# EAGLE design zx81_kbd v0.4 (EAGLE 9.6.2)
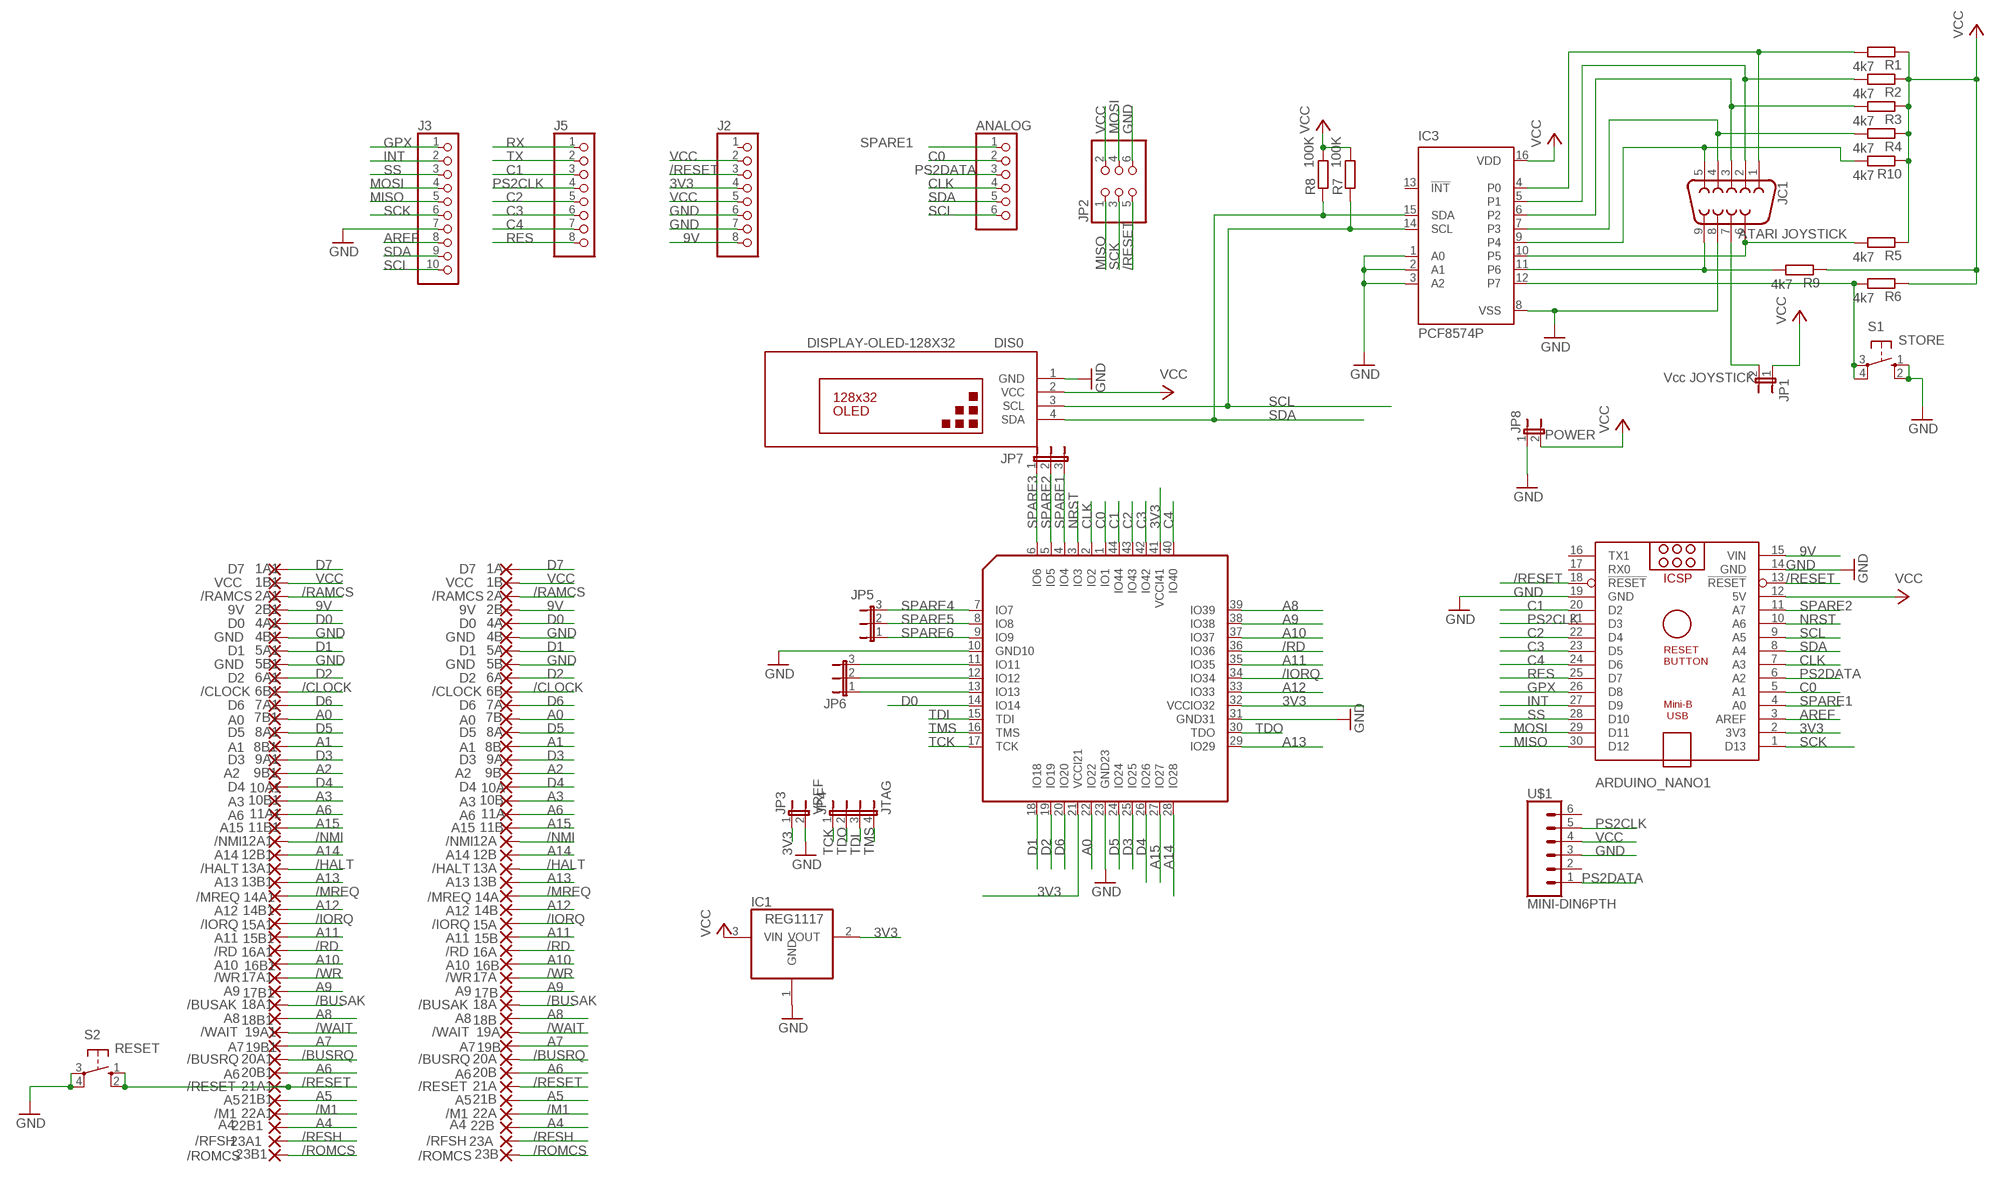
[diagram p0: schematic, sheet 1]

## Parts
1A  D7  SMD2EDGEPIN  [EDGEPIN]
1A1  D7  SMD2EDGEPIN  [EDGEPIN]
1B  VCC  SMD2EDGEPIN  [EDGEPIN]
1B1  VCC  SMD2EDGEPIN  [EDGEPIN]
2A  /RAMCS  SMD2EDGEPIN  [EDGEPIN]
2A1  /RAMCS  SMD2EDGEPIN  [EDGEPIN]
2B  9V  SMD2EDGEPIN  [EDGEPIN]
2B1  9V  SMD2EDGEPIN  [EDGEPIN]
4A  D0  SMD2EDGEPIN  [EDGEPIN]
4A1  D0  SMD2EDGEPIN  [EDGEPIN]
4B  GND  SMD2EDGEPIN  [EDGEPIN]
4B1  GND  SMD2EDGEPIN  [EDGEPIN]
5A  D1  SMD2EDGEPIN  [EDGEPIN]
5A1  D1  SMD2EDGEPIN  [EDGEPIN]
5B  GND  SMD2EDGEPIN  [EDGEPIN]
5B1  GND  SMD2EDGEPIN  [EDGEPIN]
6A  D2  SMD2EDGEPIN  [EDGEPIN]
6A1  D2  SMD2EDGEPIN  [EDGEPIN]
6B  /CLOCK  SMD2EDGEPIN  [EDGEPIN]
6B1  /CLOCK  SMD2EDGEPIN  [EDGEPIN]
7A  D6  SMD2EDGEPIN  [EDGEPIN]
7A1  D6  SMD2EDGEPIN  [EDGEPIN]
7B  A0  SMD2EDGEPIN  [EDGEPIN]
7B1  A0  SMD2EDGEPIN  [EDGEPIN]
8A  D5  SMD2EDGEPIN  [EDGEPIN]
8A1  D5  SMD2EDGEPIN  [EDGEPIN]
8B  A1  SMD2EDGEPIN  [EDGEPIN]
8B1  A1  SMD2EDGEPIN  [EDGEPIN]
9A  D3  SMD2EDGEPIN  [EDGEPIN]
9A1  D3  SMD2EDGEPIN  [EDGEPIN]
9B  A2  SMD2EDGEPIN  [EDGEPIN]
9B1  A2  SMD2EDGEPIN  [EDGEPIN]
10A  D4  SMD2EDGEPIN  [EDGEPIN]
10A1  D4  SMD2EDGEPIN  [EDGEPIN]
10B  A3  SMD2EDGEPIN  [EDGEPIN]
10B1  A3  SMD2EDGEPIN  [EDGEPIN]
11A  A6  SMD2EDGEPIN  [EDGEPIN]
11A1  A6  SMD2EDGEPIN  [EDGEPIN]
11B  A15  SMD2EDGEPIN  [EDGEPIN]
11B1  A15  SMD2EDGEPIN  [EDGEPIN]
12A  /NMI  SMD2EDGEPIN  [EDGEPIN]
12A1  /NMI  SMD2EDGEPIN  [EDGEPIN]
12B  A14  SMD2EDGEPIN  [EDGEPIN]
12B1  A14  SMD2EDGEPIN  [EDGEPIN]
13A  /HALT  SMD2EDGEPIN  [EDGEPIN]
13A1  /HALT  SMD2EDGEPIN  [EDGEPIN]
13B  A13  SMD2EDGEPIN  [EDGEPIN]
13B1  A13  SMD2EDGEPIN  [EDGEPIN]
14A  /MREQ  SMD2EDGEPIN  [EDGEPIN]
14A1  /MREQ  SMD2EDGEPIN  [EDGEPIN]
14B  A12  SMD2EDGEPIN  [EDGEPIN]
14B1  A12  SMD2EDGEPIN  [EDGEPIN]
15A  /IORQ  SMD2EDGEPIN  [EDGEPIN]
15A1  /IORQ  SMD2EDGEPIN  [EDGEPIN]
15B  A11  SMD2EDGEPIN  [EDGEPIN]
15B1  A11  SMD2EDGEPIN  [EDGEPIN]
16A  /RD  SMD2EDGEPIN  [EDGEPIN]
16A1  /RD  SMD2EDGEPIN  [EDGEPIN]
16B  A10  SMD2EDGEPIN  [EDGEPIN]
16B1  A10  SMD2EDGEPIN  [EDGEPIN]
17A  /WR  SMD2EDGEPIN  [EDGEPIN]
17A1  /WR  SMD2EDGEPIN  [EDGEPIN]
17B  A9  SMD2EDGEPIN  [EDGEPIN]
17B1  A9  SMD2EDGEPIN  [EDGEPIN]
18A  /BUSAK  SMD2EDGEPIN  [EDGEPIN]
18A1  /BUSAK  SMD2EDGEPIN  [EDGEPIN]
18B  A8  SMD2EDGEPIN  [EDGEPIN]
18B1  A8  SMD2EDGEPIN  [EDGEPIN]
19A  /WAIT  SMD2EDGEPIN  [EDGEPIN]
19A1  /WAIT  SMD2EDGEPIN  [EDGEPIN]
19B  A7  SMD2EDGEPIN  [EDGEPIN]
19B1  A7  SMD2EDGEPIN  [EDGEPIN]
20A  /BUSRQ  SMD2EDGEPIN  [EDGEPIN]
20A1  /BUSRQ  SMD2EDGEPIN  [EDGEPIN]
20B  A6  SMD2EDGEPIN  [EDGEPIN]
20B1  A6  SMD2EDGEPIN  [EDGEPIN]
21A  /RESET  SMD2EDGEPIN  [EDGEPIN]
21A1  /RESET  SMD2EDGEPIN  [EDGEPIN]
21B  A5  SMD2EDGEPIN  [EDGEPIN]
21B1  A5  SMD2EDGEPIN  [EDGEPIN]
22A  /M1  SMD2EDGEPIN  [EDGEPIN]
22A1  /M1  SMD2EDGEPIN  [EDGEPIN]
22B  A4  SMD2EDGEPIN  [EDGEPIN]
22B1  A4  SMD2EDGEPIN  [EDGEPIN]
23A  /RFSH  SMD2EDGEPIN  [EDGEPIN]
23A1  /RFSH  SMD2EDGEPIN  [EDGEPIN]
23B  /ROMCS  SMD2EDGEPIN  [EDGEPIN]
23B1  /ROMCS  SMD2EDGEPIN  [EDGEPIN]
ANALOG  PINHD-1X6  [1X06]
ARDUINO_NANO1  ARDUINO_NANO  [ARDUINO_NANO]
DIS0  DISPLAY-OLED-128X32  [DISPLAY-OLED-128X32]
IC1  REG1117  [SOT223]
IC3  PCF8574P  [DIL16]
J2  PINHD-1X8  [1X08]
J3  PINHD-1X10  [1X10]
J5  PINHD-1X8  [1X08]
JC1  ATARI JOYSTICK  DB9MALE  [DB9_MALE]
JP1  Vcc JOYSTICK  JP1E  [JP1]
JP2  PINHD-2X3  [2X03]
JP3  VREF  JP1E  [JP1]
JP4  JTAG  JP4E  [JP4]
JP5  JP2E  [JP2]
JP6  JP2E  [JP2]
JP7  JP2E  [JP2]
JP8  POWER  JP1E  [JP1]
R1  4k7  R-EU_0204/7  [0204/7]
R2  4k7  R-EU_0204/7  [0204/7]
R3  4k7  R-EU_0204/7  [0204/7]
R4  4k7  R-EU_0204/7  [0204/7]
R5  4k7  R-EU_0204/7  [0204/7]
R6  4k7  R-EU_0204/7  [0204/7]
R7  100K  R-EU_0204/7  [0204/7]
R8  100K  R-EU_0204/7  [0204/7]
R9  4k7  R-EU_0204/7  [0204/7]
R10  4k7  R-EU_0204/7  [0204/7]
S1  STORE  10-XX11MM  [B3F-10XX_11MM]
S2  RESET  10-XX11MM  [B3F-10XX_11MM]
U$1  MINI-DIN6PTH  [MINI-DIN6]
XC95CPLD  XC9572PLC  [3M44]

## Nets
3V3 [VCC]: ARDUINO_NANO1.2(3V3) IC1.2(VOUT) J2.4 JP3.1 XC95CPLD.21(VCCI21) XC95CPLD.32(VCCIO32) XC95CPLD.41(VCCI41)
9V [VCC]: 2B1.1(P) 2B.1(P) ARDUINO_NANO1.15(VIN) J2.8
/BUSAK: 18A1.1(P) 18A.1(P)
/BUSRQ: 20A1.1(P) 20A.1(P)
/CLOCK: 6B1.1(P) 6B.1(P)
/HALT: 13A1.1(P) 13A.1(P)
/IORQ: 15A1.1(P) 15A.1(P) XC95CPLD.34(IO34)
/M1: 22A1.1(P) 22A.1(P)
/MREQ: 14A1.1(P) 14A.1(P)
/NMI: 12A1.1(P) 12A.1(P)
/RAMCS: 2A1.1(P) 2A.1(P)
/RD: 16A1.1(P) 16A.1(P) XC95CPLD.36(IO36)
/RESET: 21A1.1(P) 21A.1(P) ARDUINO_NANO1.13(!RESET) ARDUINO_NANO1.18(!RESET) J2.3 JP2.5 S2.1(S) S2.2(S1)
/RFSH: 23A1.1(P) 23A.1(P)
/ROMCS: 23B1.1(P) 23B.1(P)
/WAIT: 19A1.1(P) 19A.1(P)
/WR: 17A1.1(P) 17A.1(P)
A0: 7B1.1(P) 7B.1(P) XC95CPLD.22(IO22)
A1: 8B1.1(P) 8B.1(P)
A2: 9B1.1(P) 9B.1(P)
A3: 10B1.1(P) 10B.1(P)
A4: 22B1.1(P) 22B.1(P)
A5: 21B1.1(P) 21B.1(P)
A6: 11A1.1(P) 11A.1(P) 20B1.1(P) 20B.1(P)
A7: 19B1.1(P) 19B.1(P)
A8: 18B1.1(P) 18B.1(P) XC95CPLD.39(IO39)
A9: 17B1.1(P) 17B.1(P) XC95CPLD.38(IO38)
A10: 16B1.1(P) 16B.1(P) XC95CPLD.37(IO37)
A11: 15B1.1(P) 15B.1(P) XC95CPLD.35(IO35)
A12: 14B1.1(P) 14B.1(P) XC95CPLD.33(IO33)
A13: 13B1.1(P) 13B.1(P) XC95CPLD.29(IO29)
A14: 12B1.1(P) 12B.1(P) XC95CPLD.28(IO28)
A15: 11B1.1(P) 11B.1(P) XC95CPLD.27(IO27)
AREF: ARDUINO_NANO1.3(AREF) J3.8
C0: ANALOG.2 ARDUINO_NANO1.5(A1) XC95CPLD.1(IO1)
C1: ARDUINO_NANO1.20(D2) J5.3 XC95CPLD.44(IO44)
C2: ARDUINO_NANO1.22(D4) J5.5 XC95CPLD.43(IO43)
C3: ARDUINO_NANO1.23(D5) J5.6 XC95CPLD.42(IO42)
C4: ARDUINO_NANO1.24(D6) J5.7 XC95CPLD.40(IO40)
CLK: ANALOG.4 ARDUINO_NANO1.7(A3) XC95CPLD.2(IO2)
D0: 4A1.1(P) 4A.1(P) XC95CPLD.14(IO14)
D1: 5A1.1(P) 5A.1(P) XC95CPLD.18(IO18)
D2: 6A1.1(P) 6A.1(P) XC95CPLD.19(IO19)
D3: 9A1.1(P) 9A.1(P) XC95CPLD.25(IO25)
D4: 10A1.1(P) 10A.1(P) XC95CPLD.26(IO26)
D5: 8A1.1(P) 8A.1(P) XC95CPLD.24(IO24)
D6: 7A1.1(P) 7A.1(P) XC95CPLD.20(IO20)
D7: 1A1.1(P) 1A.1(P)
GND [VCC]: 4B1.1(P) 4B.1(P) 5B1.1(P) 5B.1(P) ARDUINO_NANO1.14(GND) ARDUINO_NANO1.19(GND) DIS0.1(GND) IC1.1(GND) IC3.1(A0) IC3.2(A1) IC3.3(A2) IC3.8(VSS) J2.6 J2.7 J3.7 JC1.8 JP2.6 JP3.2 JP8.1 S1.1(S) S1.2(S1) S2.3(P) S2.4(P1) U$1.3 XC95CPLD.10(GND10) XC95CPLD.23(GND23) XC95CPLD.31(GND31)
GPX: ARDUINO_NANO1.26(D8) J3.1
INT: ARDUINO_NANO1.27(D9) J3.2
MISO: ARDUINO_NANO1.30(D12) J3.5 JP2.1
MOSI: ARDUINO_NANO1.29(D11) J3.4 JP2.4
N$1: JP6.3 XC95CPLD.11(IO11)
N$2: JP6.2 XC95CPLD.12(IO12)
N$3: JP6.1 XC95CPLD.13(IO13)
N$29: IC3.4(P0) JC1.1 R1.2
N$32: IC3.5(P1) JC1.2 R2.2
N$33: IC3.6(P2) JC1.3 R3.2
N$34: IC3.7(P3) JC1.4 R4.2
N$35: IC3.10(P5) JC1.6 R5.2
N$36: IC3.9(P4) JC1.5 R10.2
N$37: IC3.12(P7) R6.2 S1.3(P) S1.4(P1)
N$38: JC1.7 JP1.2
N$39: IC3.11(P6) JC1.9 R9.2
NRST: ARDUINO_NANO1.10(A6) XC95CPLD.3(IO3)
PS2CLK: ARDUINO_NANO1.21(D3) J5.4 U$1.5
PS2DATA: ANALOG.3 ARDUINO_NANO1.6(A2) U$1.1
RES: ARDUINO_NANO1.25(D7) J5.8
RX: J5.1
SCK: ARDUINO_NANO1.1(D13) J3.6 JP2.3
SCL: ANALOG.6 ARDUINO_NANO1.9(A5) DIS0.3(SCL) IC3.14(SCL) J3.10 R7.1
SDA: ANALOG.5 ARDUINO_NANO1.8(A4) DIS0.4(SDA) IC3.15(SDA) J3.9 R8.1
SPARE1: ANALOG.1 ARDUINO_NANO1.4(A0) JP7.3 XC95CPLD.4(IO4)
SPARE2: ARDUINO_NANO1.11(A7) JP7.2 XC95CPLD.5(IO5)
SPARE3: JP7.1 XC95CPLD.6(IO6)
SPARE4: JP5.3 XC95CPLD.7(IO7)
SPARE5: JP5.2 XC95CPLD.8(IO8)
SPARE6: JP5.1 XC95CPLD.9(IO9)
SS: ARDUINO_NANO1.28(D10) J3.3
TCK: JP4.1 XC95CPLD.17(TCK)
TDI: JP4.3 XC95CPLD.15(TDI)
TDO: JP4.2 XC95CPLD.30(TDO)
TMS: JP4.4 XC95CPLD.16(TMS)
TX: J5.2
VCC [VCC]: 1B1.1(P) 1B.1(P) ARDUINO_NANO1.12(5V) DIS0.2(VCC) IC1.3(VIN) IC3.16(VDD) J2.2 J2.5 JP1.1 JP2.2 JP8.2 R1.1 R2.1 R3.1 R4.1 R5.1 R6.1 R7.2 R8.2 R9.1 R10.1 U$1.4
Unconnected: ARDUINO_NANO1.16(TX1) ARDUINO_NANO1.17(RX0) IC3.13(!INT) J2.1 U$1.2 U$1.6

## Library data of the parts
1A 1A1 1B 1B1 2A 2A1 2B 2B1 4A 4A1 4B 4B1 5A 5A1 5B 5B1 6A 6A1 6B 6B1 7A 7A1 7B 7B1 8A 8A1 8B 8B1 9A 9A1 9B 9B1 10A 10A1 10B 10B1 11A 11A1 11B 11B1 12A 12A1 12B 12B1 13A 13A1 13B 13B1 14A 14A1 14B 14B1 15A 15A1 15B 15B1 16A 16A1 16B 16B1 17A 17A1 17B 17B1 18A 18A1 18B 18B1 19A 19A1 19B 19B1 20A 20A1 20B 20B1 21A 21A1 21B 21B1 22A 22A1 22B 22B1 23A 23A1 23B 23B1 = wirepad:SMD2: SMD PAD
ANALOG = pinhead:PINHD-1X6: PIN HEADER
ARDUINO_NANO1 = ArduinoNanoV30:ARDUINO_NANO: Arduino Nano V3.0 Overview: The Arduino Nano is a small, complete, and breadboard-friendly board based on the ATmega328 (Arduino Nano 3.x) or ATmega168 (Arduino Nano 2.x). It has more or less the same functionality of the Arduino Duemilanove, but in a different package. It lacks only a DC power jack, and works with a Mini-B USB cable instead of a standard one. The Nano was designed and is being produced by Gravitech. Specifications: Microcontroller Atmel ATmega168 or ATmega328 Operating Voltage (logic level) 5 V Input Voltage (recommended) 7-12 V Input Voltage (limits) 6-20 V Digital I/O Pins 14 (of which 6 provide PWM output) Analog Input Pins 8 DC Current per I/O Pin 40 mA Flash Memory 16 KB (ATmega168) or 32 KB (ATmega328) of which 2 KB used by bootloader SRAM 1 KB (ATmega168) or 2 KB (ATmega328) EEPROM 512 bytes (ATmega168) or 1 KB (ATmega328) Clock Speed 16 MHz Dimensions 0.73" x 1.70" Length 45 mm Width 18 mm Weigth 5 g Power: The Arduino Nano can be powered via the Mini-B USB connection, 6-20V unregulated external power supply (pin 30), or 5V regulated external power supply (pin 27). The power source is automatically selected to the highest voltage source. Memory: The ATmega168 has 16 KB of flash memory for storing code (of which 2 KB is used for the bootloader); the ATmega328 has 32 KB, (also with 2 KB used for the bootloader). The ATmega168 has 1 KB of SRAM and 512 bytes of EEPROM (which can be read and written with the EEPROM library); the ATmega328 has 2 KB of SRAM and 1 KB of EEPROM. Input and Output: Each of the 14 digital pins on the Nano can be used as an input or output, using pinMode(), digitalWrite(), and digitalRead() functions. They operate at 5 volts. Each pin can provide or receive a maximum of 40 mA and has an internal pull-up resistor (disconnected by default) of 20-50 kOhms. In addition, some pins have specialized functions. Visit Arduino - ArduinoBoardNano <https://www.arduino.cc/en/Main/ArduinoBoardNano>
DIS0 = diy-modules:DISPLAY-OLED-128X32: 128x32 Dot Matrix OLED Module with I2C interface based on SSD1306 chip More details available here: http://www.tinyosshop.com/index.php?route=product/product&product_id=953 Schematic available here: http://www.tinyosshop.com/datasheet/OLED%2012832.pdf SSD1306 datasheet: https://cdn-shop.adafruit.com/datasheets/SSD1306.pdf Click here to find device on ebay.com <http://www.ebay.com/sch/oled+display+128x32+i2c>
IC1 = burr-brown:REG1117: 800mA and 1A Low Dropout (LDO) Positive Regulator 1.8V, 2.5V, 2.85V, 3.3V, 5V, and Adj; MPN: REG1117
IC3 = micro-philips:PCF8574: I2C-Bus Remote 8-bit I/O expander http://www.semiconductors.philips.com/acrobat_download/datasheets/PCF8574_4.pdf; MPN: PCF8574PN; OC_FARNELL: 204020; OC_NEWARK: 11N8515
J2 J5 = pinhead:PINHD-1X8: PIN HEADER
J3 = pinhead:PINHD-1X10: PIN HEADER
JC1 = SparkFun-Connectors:DB9: DB9 Connector Standard DB9 (D-Sub 9) serial connector. Can be used for CAN bus as well as RS485 and RS232. Footprint production proven. Here is the female version connector we sell at SparkFun: 9 Pin Female Serial Connector - PCB Mount <https://www.sparkfun.com/products/429> (PRT-00429) This connector has been used on the following SparkFun products: SparkFun RS232 Shifter - SMD <https://www.sparkfun.com/products/449> (PRT-00449) SparkFun RS232 Shifter SMD (No DB9) <https://www.sparkfun.com/products/8780> (PRT-08780); PROD_ID: CONN-09904
JP1 JP3 JP8 = jumper:JP1E: JUMPER
JP2 = pinhead:PINHD-2X3: PIN HEADER
JP4 = jumper:JP4E: JUMPER
JP5-JP7 = jumper:JP2E: JUMPER
R1-R10 = rcl:R-EU_: RESISTOR, European symbol; SPICEPREFIX: R
S1 S2 = switch-omron:10-XX: OMRON SWITCH
U$1 = SparkFun-Retired:MINI-DIN6: Mini DIN 6 Connector SparkFun used to sell this connector and has used it on a couple designs, however the connector and the designs are now retired. Mini DIN 6 Connector [RETIRED] <https://www.sparkfun.com/products/retired/8509> SparkFun Key Counter - PS2 [RETIRED] <https://www.sparkfun.com/products/retired/8652> Commonly found on the back of a computer for PS2 keyboard and mice. Schematic and footprint are proven.
XC95CPLD = xilinx_9:XC9572PLC

## Net classes
0 default: width 0.254 mm, drill 0.2 mm, clearance 0.127 mm
1 VCC: width 0.4 mm

## Board
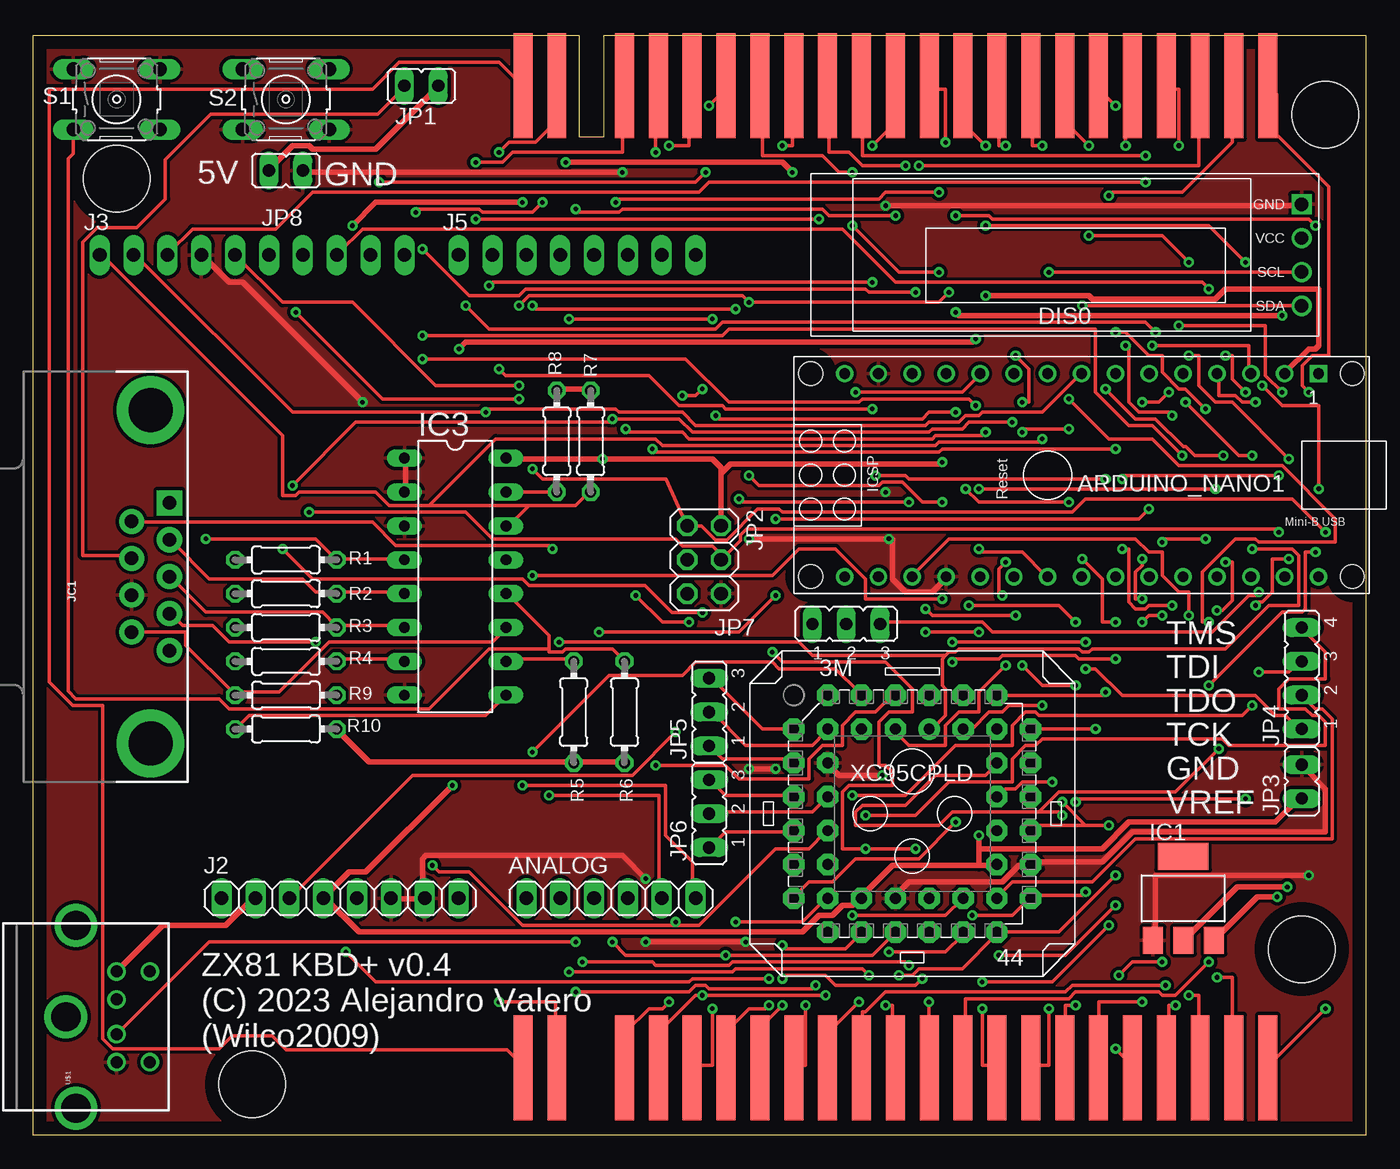
[diagram p1: board, top side]
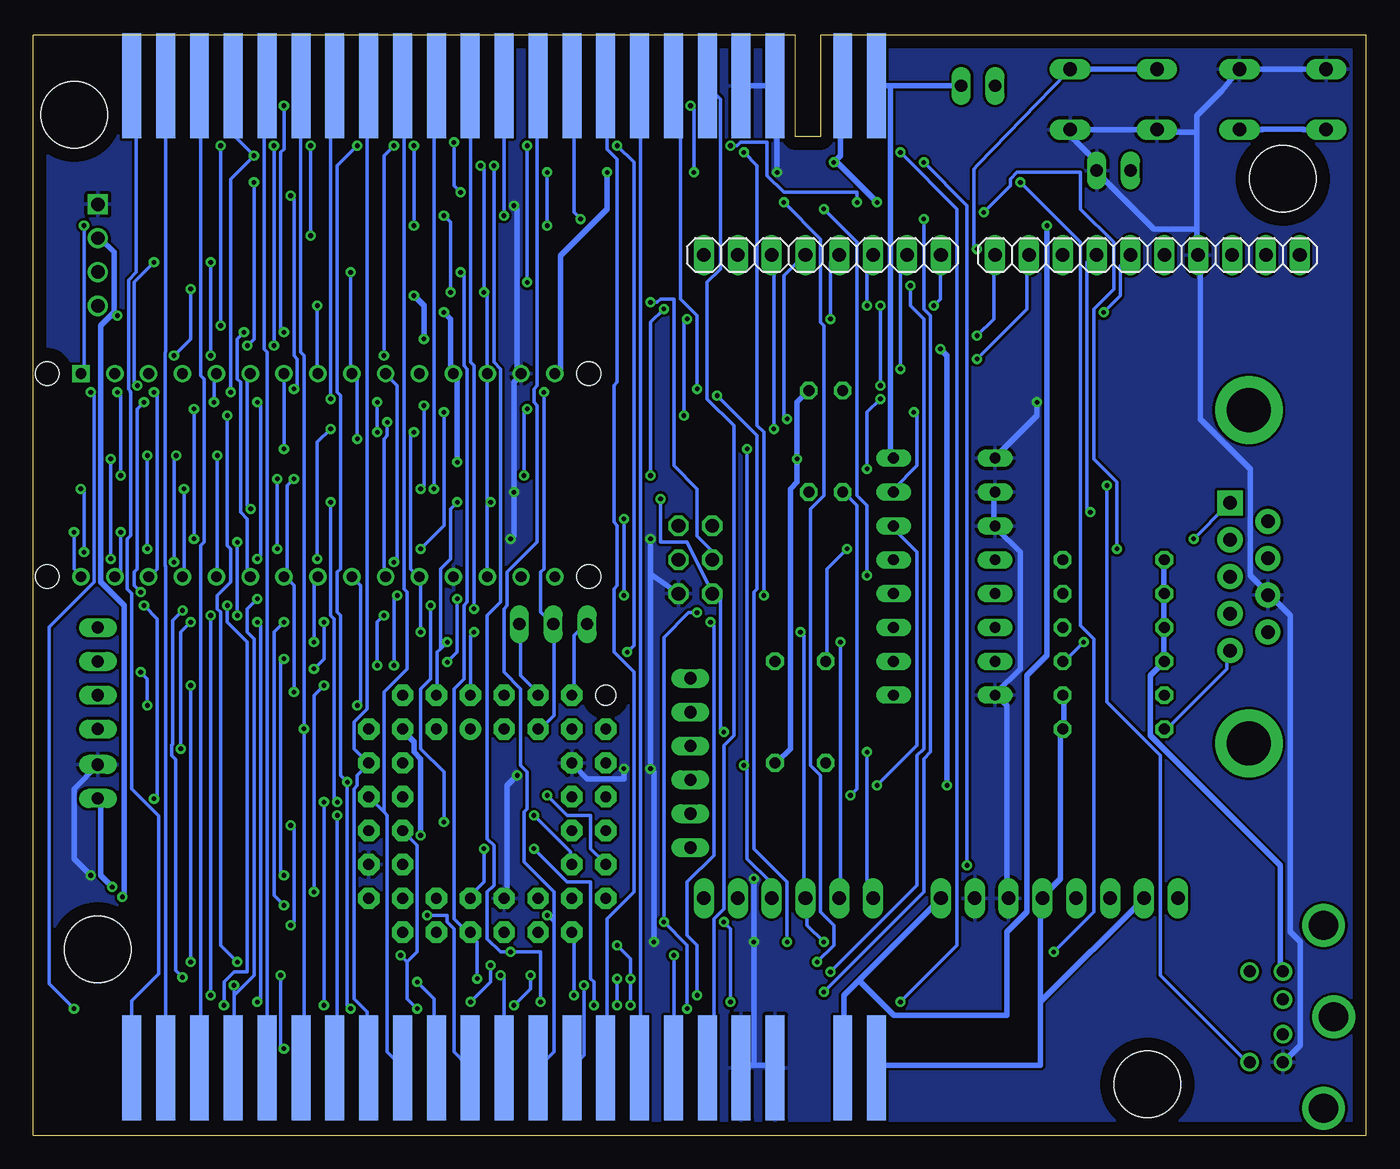
[diagram p2: board, bottom side, seen from below]

Size 99.99 x 82.55 mm. Coordinates in mm from the lower left corner, seen from the top.
Outline: 99.99,0 99.99,82.55 42.83,82.55 42.83,74.93 40.92,74.93 40.92,82.55 0,82.55 0,0 99.99,0
Copper layers (1*16): Top 0.035mm / dielectric 1.5mm / Bottom 0.035mm
Design rules "default": minimum track width 6mil, minimum drill 0.35mm, track to track 6mil, track to pad 6mil, pad to pad 6mil, via to via 6mil, smd to smd 6mil, copper to edge 40mil, drill to drill 6mil, minimum pad ring 10mil, minimum via ring 8mil, stop-mask expansion 4mil, vias tented up to drill 0mil, thermal gap 10mil
Holes 5 mm at 6.25,71.75 16.41,3.81 95.15,13.97 96.93,76.58

### Footprints (pad centres in the part's own frame; a part is rotated, then mirrored left to right if it is on the bottom)
EDGEPIN = smd 1.422 x 7.874: 1 0,0
1X06 = drill 1.016 long: 1 -6.35,0; 2 -3.81,0; 3 -1.27,0; 4 1.27,0; 5 3.81,0; 6 6.35,0
ARDUINO_NANO = drill 0.8 square: 1 -20.32,-7.62 | drill 0.8: 2 -17.78,-7.62; 3 -15.24,-7.62; 4 -12.7,-7.62; 5 -10.16,-7.62; 6 -7.62,-7.62; 7 -5.08,-7.62; 8 -2.54,-7.62; 9 0,-7.62; 10 2.54,-7.62; 11 5.08,-7.62; 12 7.62,-7.62; 13 10.16,-7.62; 14 12.7,-7.62; 15 15.24,-7.62; 16 15.24,7.62; 17 12.7,7.62; 18 10.16,7.62; 19 7.62,7.62; 20 5.08,7.62; 21 2.54,7.62; 22 0,7.62; 23 -2.54,7.62; 24 -5.08,7.62; 25 -7.62,7.62; 26 -10.16,7.62; 27 -12.7,7.62; 28 -15.24,7.62; 29 -17.78,7.62; 30 -20.32,7.62 | hole 1.778: -22.86,-7.62; -22.86,7.62; 17.78,7.62; 17.78,-7.62
DISPLAY-OLED-128X32 = drill 1 square: 1 -17.78,-3.81 | drill 1: 2 -17.78,-1.27; 3 -17.78,1.27; 4 -17.78,3.81
SOT223 = smd 1.499 x 2.007: 1 -2.261,-3.15; 2 0.025,-3.15; 3 2.311,-3.15 | smd 3.81 x 2.007: 4 0,3.15
DIL16 = drill 0.813 long: 1 -8.89,-3.81; 2 -6.35,-3.81; 3 -3.81,-3.81; 4 -1.27,-3.81; 5 1.27,-3.81; 6 3.81,-3.81; 7 6.35,-3.81; 8 8.89,-3.81; 9 8.89,3.81; 10 6.35,3.81; 11 3.81,3.81; 12 1.27,3.81; 13 -1.27,3.81; 14 -3.81,3.81; 15 -6.35,3.81; 16 -8.89,3.81
1X08 = drill 1.016 long: 1 -8.89,0; 2 -6.35,0; 3 -3.81,0; 4 -1.27,0; 5 1.27,0; 6 3.81,0; 7 6.35,0; 8 8.89,0
1X10 = drill 1.016 long: 1 -11.43,0; 2 -8.89,0; 3 -6.35,0; 4 -3.81,0; 5 -1.27,0; 6 1.27,0; 7 3.81,0; 8 6.35,0; 9 8.89,0; 10 11.43,0
DB9_MALE = drill 1.016 pad 1.88 square: 1 5.54,-1.42 | drill 1.016 pad 1.88: 2 2.77,-1.42; 3 0,-1.42; 4 -2.77,-1.42; 5 -5.54,-1.42; 6 4.15,1.42; 7 1.38,1.42; 8 -1.38,1.42; 9 -4.15,1.42 | drill 3.302 pad 5.08: G1 -12.5,0; G2 12.5,0
JP1 = drill 0.914 long: 1 0,-1.27; 2 0,1.27
2X03 = drill 1.016 octagon: 1 -2.54,-1.27; 2 -2.54,1.27; 3 0,-1.27; 4 0,1.27; 5 2.54,-1.27; 6 2.54,1.27
JP4 = drill 0.914 long: 1 -3.81,0; 2 -1.27,0; 3 1.27,0; 4 3.81,0
JP2 = drill 0.914 long: 1 -2.54,0; 2 0,0; 3 2.54,0
0204/7 = drill 0.813 octagon: 1 -3.81,0; 2 3.81,0
B3F-10XX_11MM = drill 1.016 long: 1 -3.251,2.261; 2 3.251,2.261; 3 -3.251,-2.261; 4 3.251,-2.261
MINI-DIN6 = drill 0.9: 1 -1.3,-8.5; 2 1.3,-8.5; 3 -3.4,-8.5; 4 3.4,-8.5; 5 -3.4,-11; 6 3.4,-11 | drill 2.2: P$1 0,-4.7; P$2 -6.858,-5.462; P$3 6.858,-5.462
3M44 = drill 0.813 pad 1.6: 1 1.27,6.35 | drill 0.813 pad 1.6 octagon: 2 -1.27,8.89; 3 -1.27,6.35; 4 -3.81,8.89; 5 -3.81,6.35; 6 -6.35,8.89; 7 -8.89,6.35; 8 -6.35,6.35; 9 -8.89,3.81; 10 -6.35,3.81; 11 -8.89,1.27; 12 -6.35,1.27; 13 -8.89,-1.27; 14 -6.35,-1.27; 15 -8.89,-3.81; 16 -6.35,-3.81; 17 -8.89,-6.35; 18 -6.35,-8.89; 19 -6.35,-6.35; 20 -3.81,-8.89; 21 -3.81,-6.35; 22 -1.27,-8.89; 23 -1.27,-6.35; 24 1.27,-8.89; 25 1.27,-6.35; 26 3.81,-8.89; 27 3.81,-6.35; 28 6.35,-8.89; 29 8.89,-6.35; 30 6.35,-6.35; 31 8.89,-3.81; 32 6.35,-3.81; 33 8.89,-1.27; 34 6.35,-1.27; 35 8.89,1.27; 36 6.35,1.27; 37 8.89,3.81; 38 6.35,3.81; 39 8.89,6.35; 40 6.35,8.89; 41 6.35,6.35; 42 3.81,8.89; 43 3.81,6.35; 44 1.27,8.89 | hole 1.499: -8.89,8.89

### Placement (x,y rotation side)
1A  36.73,5.08 0 top
1A1  36.73,78.74 0 top
1B  36.73,5.08 0 bottom
1B1  36.73,78.74 0 bottom
2A  39.27,5.08 0 top
2A1  39.27,78.74 0 top
2B  39.27,5.08 0 bottom
2B1  39.27,78.74 0 bottom
4A  44.35,5.08 0 top
4A1  44.35,78.74 0 top
4B  44.35,5.08 0 bottom
4B1  44.35,78.74 0 bottom
5A  46.89,5.08 0 top
5A1  46.89,78.74 0 top
5B  46.89,5.08 0 bottom
5B1  46.89,78.74 0 bottom
6A  49.43,5.08 0 top
6A1  49.43,78.74 0 top
6B  49.43,5.08 0 bottom
6B1  49.43,78.74 0 bottom
7A  51.97,5.08 0 top
7A1  51.97,78.74 0 top
7B  51.97,5.08 0 bottom
7B1  51.97,78.74 0 bottom
8A  54.51,5.08 0 top
8A1  54.51,78.74 0 top
8B  54.51,5.08 0 bottom
8B1  54.51,78.74 0 bottom
9A  57.05,5.08 0 top
9A1  57.05,78.74 0 top
9B  57.05,5.08 0 bottom
9B1  57.05,78.74 0 bottom
10A  59.59,5.08 0 top
10A1  59.59,78.74 0 top
10B  59.59,5.08 0 bottom
10B1  59.59,78.74 0 bottom
11A  62.13,5.08 0 top
11A1  62.13,78.74 0 top
11B  62.13,5.08 0 bottom
11B1  62.13,78.74 0 bottom
12A  64.67,5.08 0 top
12A1  64.67,78.74 0 top
12B  64.67,5.08 0 bottom
12B1  64.67,78.74 0 bottom
13A  67.21,5.08 0 top
13A1  67.21,78.74 0 top
13B  67.21,5.08 0 bottom
13B1  67.21,78.74 0 bottom
14A  69.75,5.08 0 top
14A1  69.75,78.74 0 top
14B  69.75,5.08 0 bottom
14B1  69.75,78.74 0 bottom
15A  72.29,5.08 0 top
15A1  72.29,78.74 0 top
15B  72.29,5.08 0 bottom
15B1  72.29,78.74 0 bottom
16A  74.83,5.08 0 top
16A1  74.83,78.74 0 top
16B  74.83,5.08 0 bottom
16B1  74.83,78.74 0 bottom
17A  77.37,5.08 0 top
17A1  77.37,78.74 0 top
17B  77.37,5.08 0 bottom
17B1  77.37,78.74 0 bottom
18A  79.91,5.08 0 top
18A1  79.91,78.74 0 top
18B  79.91,5.08 0 bottom
18B1  79.91,78.74 0 bottom
19A  82.45,5.08 0 top
19A1  82.45,78.74 0 top
19B  82.45,5.08 0 bottom
19B1  82.45,78.74 0 bottom
20A  84.99,5.08 0 top
20A1  84.99,78.74 0 top
20B  84.99,5.08 0 bottom
20B1  84.99,78.74 0 bottom
21A  87.53,5.08 0 top
21A1  87.53,78.74 0 top
21B  87.53,5.08 0 bottom
21B1  87.53,78.74 0 bottom
22A  90.07,5.08 0 top
22A1  90.07,78.74 0 top
22B  90.07,5.08 0 bottom
22B1  90.07,78.74 0 bottom
23A  92.61,5.08 0 top
23A1  92.61,78.74 0 top
23B  92.61,5.08 0 bottom
23B1  92.61,78.74 0 bottom
ANALOG  43.33,17.78 0 top
ARDUINO_NANO1  76.1,49.53 180 top
DIS0  77.37,66.04 180 top
IC1  86.26,17.78 0 top
IC3  31.65,41.91 270 top
J2  23.01,17.78 0 top
J3  16.41,66.04 0 bottom
J5  40.79,66.04 0 bottom
JC1  8.79,41.91 90 top
JP1  29.11,78.74 90 top
JP2  50.32,43.18 270 top
JP3  95.15,26.54 0 top
JP4  95.15,34.29 90 top
JP5  50.7,31.75 90 top
JP6  50.7,24.13 90 top
JP7  60.99,38.35 0 top
JP8  18.95,72.39 90 top
R1  18.95,43.18 0 top
R2  18.95,40.64 0 top
R3  18.95,38.1 0 top
R4  18.95,35.56 0 top
R5  40.54,31.75 90 top
R6  44.35,31.75 90 top
R7  41.81,52.07 90 top
R8  39.27,52.07 90 top
R9  18.95,33.02 180 top
R10  18.95,30.48 180 top
S1  6.25,77.72 0 top
S2  18.95,77.72 0 top
U$1  -2.26,8.89 90 top
XC95CPLD  65.94,24.13 0 top

### Tracks (layer width: path | path; a pad name or v marks a point on that pad's centre or on a via)
3V3  (via drill 0.35)
  Top 0.4: v94.07,18.63 90.32,18.63 86.44,14.75 IC1.2 | 70.94,20.25 72.19,20.25 XC95CPLD.32 | 70.94,20.25 64.44,20.25 62.19,18 XC95CPLD.21 61.94,17.75 61.44,17.25 60.69,17.25 59.94,16.5 58.94,16.5 57.69,15.25 24.44,15.25 21.94,17.75 J2.4 21.94,18 23.69,19.75 24.94,19.75 v31.44,26.25 | 70.94,20.25 70.94,21.5 | 70.94,21.5 v70.94,22.5 | 70.94,21.5 80.19,21.5 82.19,23.5 93.19,23.5 94.94,25.25 JP3.1 | v71.44,63 79.19,63 79.44,62.75 88.69,62.75 89.44,63.5 96.44,63.5 96.44,59.25 96.19,59 95.69,59 93.94,57.25 ARDUINO_NANO1.2 | v70.69,59.75 70.44,59.5 32.44,59.5 v31.94,59
  Bottom 0.4: v94.07,18.63 94.94,19.5 94.94,25.25 JP3.1 | v70.94,22.5 70.94,28.25 71.44,28.75 71.44,29.5 72.19,30.25 XC95CPLD.41 | v71.44,63 70.69,62.25 v70.69,59.75 | v31.94,59 31.44,58.5 v31.44,26.25
9V  (via drill 0.35)
  Top 0.4: v56.94,72.25 56.19,73 v39.94,73 | v23.94,68.25 25.69,70 v36.69,70
  Bottom 0.4: 38.06,11.62 39.19,10.5 39.19,5.25 2B.1 | 38.06,11.62 31.94,17.75 J2.8 | v56.94,72.25 56.94,69.5 60.44,66 60.44,57.5 60.69,57.25 ARDUINO_NANO1.15 | 2B1.1 39.44,78.5 39.44,73.5 v39.94,73 39.69,73 v36.69,70 | 38.06,11.62 35.44,9 26.94,9 26.94,15.25 25.44,16.75 25.44,34.5 23.94,36 v23.94,68.25
/BUSAK  (via drill 0.35)
  Top 0.254: v83.19,10 79.94,10 79.94,5.25 18A.1 | v83.19,38.5 83.69,39 v84.69,39 | v84.69,44.5 84.94,44.75 v87.94,44.75 | v87.94,54.5 86.44,56 85.94,56 84.69,57.25 84.69,58.5 83.69,58.5 81.94,60.25 v81.19,60.25 | v81.19,77.25 79.94,78.5 18A1.1
  Bottom 0.254: v83.19,10 82.94,10.25 82.94,38.25 v83.19,38.5 | v84.69,44.5 v84.69,39 | v87.94,54.5 v87.94,44.75 | v81.19,60.25 81.44,60.5 81.44,73.75 81.19,74 v81.19,77.25
/BUSRQ  (via drill 0.35)
  Top 0.254: v85.69,9.75 85.19,9.75 85.19,5.25 20A.1 | v85.44,39.75 83.69,39.75 83.44,39.5 82.69,39.5 82.19,40 82.19,44 v81.69,44 | v81.69,49.25 81.94,49.5 v93.44,49.5 | v93.69,55.75 92.44,57 92.44,60.75 v85.94,60.75 | v85.94,74.25 85.94,78.5 85.19,78.5 20A1.1
  Bottom 0.254: v85.69,9.75 85.69,11.5 84.94,12.25 83.94,12.25 83.94,37 85.44,38.5 v85.44,39.75 | v81.69,49.25 v81.69,44 | v93.44,49.5 93.44,55.5 v93.69,55.75 | v85.94,74.25 v85.94,60.75
/CLOCK
  Bottom 0.254: 6B1.1 48.44,77.75 48.44,65 49.44,64 49.44,55.25 47.44,53.25 47.44,30 48.19,29.25 48.19,17 48.94,16.25 48.94,5.5 49.19,5.25 6B.1
/HALT  (via drill 0.35)
  Top 0.254: v67.19,10 67.19,5.25 13A.1 | v65.69,12.75 65.44,13 52.44,13 52.19,12.75 46.69,12.75 46.44,13 v41.19,13 | v43.69,70 43.94,70.25 63.44,70.25 63.94,70.75 v67.94,70.75 | v68.44,74.5 68.44,78.5 67.44,78.5 13A1.1
  Bottom 0.254: v67.19,10 65.69,11.5 v65.69,12.75 | v41.19,13 39.94,14.25 39.94,15.75 40.94,16.75 40.94,27 41.69,27.75 41.69,47 40.69,48 40.69,60.75 40.94,61 40.94,67.25 v43.69,70 | v67.94,70.75 68.44,71.25 v68.44,74.5
/IORQ  (via drill 0.35)
  Top 0.254: v71.19,9.5 71.19,5.25 72.19,5.25 15A.1 | v72.94,74.25 72.44,74.25 72.44,78.5 15A1.1 | v73.69,58.5 74.69,57.5 74.69,55 v74.19,55 | v74.19,52.75 74.44,53 v77.69,53 | v78.69,43.25 80.19,41.75 80.19,38.5 v81.19,38.5 | v81.19,17.25 77.44,13.5 v72.44,13.5
  Bottom 0.254: 71.94,13 71.19,13.75 71.19,21.75 72.19,22.75 XC95CPLD.34 | 71.94,13 71.94,10.25 v71.19,9.5 | v72.94,74.25 73.69,73.5 v73.69,58.5 | v74.19,52.75 v74.19,55 | v77.69,53 78.69,52 v78.69,43.25 | v81.19,38.5 81.94,37.75 81.94,18 v81.19,17.25 | 71.94,13 v72.44,13.5
/M1  (via drill 0.35)
  Top 0.254: v88.81,11.86 89.94,11.86 89.94,5.25 22A.1 | v89.44,43 89.94,43 89.94,40.13 89.18,39.37 v88.8,39.37 | v80.44,56 82.69,53.75 84.19,53.75 86.28,51.66 86.46,51.66 87.12,51 v89.28,51 | v80.69,70.5 80.94,70.75 86.19,70.75 89.94,74.5 89.94,78.5 22A1.1
  Bottom 0.254: v88.81,11.86 89.31,12.36 89.31,28.2 89.6,28.48 89.6,29.27 89.53,29.34 89.53,38.64 v88.8,39.37 | v89.44,43 89.44,51 v89.28,51 | v80.44,56 80.19,56.25 80.19,58.25 80.44,58.5 80.44,70.25 v80.69,70.5
/MREQ  (via drill 0.35)
  Top 0.254: v88.19,13 85.69,10.5 84.69,10.5 84.44,10.75 78.19,10.75 77.69,10.25 69.94,10.25 69.94,5.25 14A.1 | v88.19,33.75 93.69,39.25 95.19,39.25 95.44,39.5 95.44,43.75 v96.19,43.75 | v96.44,48.5 96.44,54.75 93.69,54.75 v92.19,56.25 | v90.94,65.5 88.19,68.25 v71.44,68.25 | v71.44,74.25 69.94,75.75 69.94,78.5 14A1.1
  Bottom 0.254: v88.19,33.75 v88.19,13 | v96.19,43.75 96.19,48.25 v96.44,48.5 | v92.19,56.25 92.44,56.5 92.44,64 v90.94,65.5 | v71.44,74.25 v71.44,68.25
/NMI  (via drill 0.35)
  Top 0.254: v63.94,9.75 64.44,9.75 64.44,5.25 12A.1 | v62.69,12 62.19,12.5 52.69,12.5 52.44,12.25 v40.19,12.25 | v34.19,63.75 34.44,64 v62.94,64 | v62.94,74.25 64.44,75.75 64.44,78.5 12A1.1
  Bottom 0.254: v63.94,9.75 62.69,11 v62.69,12 | v40.19,12.25 33.69,18.75 33.69,28.5 33.19,29 33.19,61.25 34.19,62.25 v34.19,63.75 | v62.94,74.25 v62.94,64
/RAMCS  (via drill 0.35)
  Top 0.254: v34.94,10 39.19,10 39.19,5.25 2A.1 | v34.94,73.75 35.69,74.5 37.69,74.5 39.19,76 39.19,78.5 2A1.1
  Bottom 0.254: v34.94,10 30.69,14.25 30.69,69.5 v34.94,73.75
/RD  (via drill 0.35)
  Top 0.254: v76.44,26.5 74.19,26.5 73.69,26 72.94,26 72.44,25.5 XC95CPLD.36 | v76.19,9.5 76.19,5.25 74.94,5.25 16A.1 | v75.69,74.25 74.94,74.25 74.94,78.5 16A1.1
  Bottom 0.254: v76.19,9.5 76.44,9.75 v76.44,26.5 76.94,27 76.94,39 77.19,39.25 77.19,42.25 76.94,42.5 76.94,55.5 77.19,55.75 77.19,72.75 v75.69,74.25
/RESET  (via drill 0.35)
  Top 0.254: v48.19,30.25 44.94,27 28.44,27 19.44,18 J2.3 | v29.19,66.5 32.69,63 36.44,63 36.94,63.5 62.44,63.5 62.69,63.25 v66.19,63.25 | v86.69,10.5 87.44,10.5 87.44,5.25 21A.1 | v86.69,39 86.69,40.75 85.94,40.75 84.69,42 84.69,43.75 83.69,43.75 82.69,44.75 68.69,44.75 65.94,42 ARDUINO_NANO1.18 | v66.44,72.75 87.44,72.75 87.44,78.5 21A1.1 | v52.94,47.75 53.19,47.5 v65.69,47.5
  Bottom 0.254: v48.19,30.25 48.44,30.5 48.44,40.27 JP2.5 50.97,44.5 52.94,44.5 v52.94,47.75 | 65.94,47.5 ARDUINO_NANO1.13 65.94,63 v66.19,63.25 66.19,72.5 v66.44,72.75 | 65.94,47.5 ARDUINO_NANO1.18 | v29.19,66.5 29.44,66.75 29.44,72.5 29.11,72.83 22.46,79.72 S2.2 | v86.69,39 v86.69,10.5 | 65.94,47.5 v65.69,47.5
  Bottom 0.4: S2.1 S2.2 22.46,79.72
/RFSH  (via drill 0.35)
  Top 0.254: v96.94,9.5 92.69,5.25 23A.1 | v95.69,55.75 95.19,56.25 95.19,57.75 95.94,58.5 97.19,58.5 97.19,71.17 93.28,75.07 93.28,78.06 23A1.1
  Bottom 0.254: v95.69,55.75 95.44,55.5 95.44,41.5 98.79,38.15 98.79,11.35 v96.94,9.5
/ROMCS
  Bottom 0.254: 23B.1 92.61,10.09 90.58,12.12 90.58,23.96 92.6,25.98 92.6,40.66 92.94,41 92.94,44.75 92.69,45 92.69,55.75 92.72,55.77 92.72,55.84 92.85,55.98 92.85,64.17 92.27,64.75 92.27,75.17 92.61,75.51 23B1.1
/WAIT  (via drill 0.35)
  Top 0.254: v81.19,6.5 82.44,5.25 19A.1 | v81.44,12 82.44,13 v84.69,13 | v85.44,54 85.19,54.25 82.94,54.25 82.19,55 82.19,59.25 v81.94,59.25 | v81.94,74.25 81.94,78.5 82.44,78.5 19A1.1
  Bottom 0.254: v81.19,6.5 81.44,6.75 v81.44,12 | v84.69,13 85.94,14.25 85.94,39.25 86.19,39.5 86.19,40.5 85.19,41.5 85.19,44 85.44,44.25 v85.44,54 | v81.94,74.25 v81.94,59.25
/WR  (via drill 0.35)
  Top 0.254: v78.19,9.75 77.44,9.75 77.44,5.25 17A.1 | v78.19,25 78.44,25.25 v90.94,25.25 | v91.69,39.75 91.94,40 92.19,40 92.94,40.75 92.94,43.25 v94.19,43.25 | v94.19,50.75 89.94,55 88.69,55 87.44,56.25 87.44,58.5 v86.69,58.5 | v86.69,65.5 84.69,67.5 v79.19,67.5 | v79.19,74.25 77.44,76 77.44,78.5 17A1.1
  Bottom 0.254: v78.19,25 v78.19,9.75 | v90.94,25.25 90.69,25.5 90.69,38.75 v91.69,39.75 | v94.19,50.75 v94.19,43.25 | v86.69,65.5 v86.69,58.5 | v79.19,74.25 v79.19,67.5
A0  (via drill 0.35)
  Top 0.254: XC95CPLD.22 64.44,15 62.94,13.5 v51.94,13.5 44.44,13.5 v43.44,14.5 | v50.19,56 49.69,55.5 v48.69,55.5
  Bottom 0.254: v51.94,13.5 51.94,5.25 7B.1 | v50.19,56 50.19,61.5 51.44,62.75 51.44,78 51.94,78.5 7B1.1 | v48.69,55.5 45.69,52.5 45.69,41 45.94,40.75 45.94,21.5 43.44,19 v43.44,14.5
A1
  Bottom 0.254: 8B.1 54.44,5.25 54.44,78.5 8B1.1
A2
  Bottom 0.254: 9B.1 56.94,5.25 56.94,16.25 54.94,18.25 54.94,34.75 56.44,36.25 56.44,41 56.19,41.25 56.19,45.75 56.44,46 56.44,56.25 56.19,56.5 56.19,73.25 56.94,74 56.94,78.5 9B1.1
A3  (via drill 0.35)
  Top 0.254: v58.69,11.25 58.44,11 50.69,11 50.44,11.25 49.69,11.25 49.19,10.75 v40.69,10.75 | v58.94,68.75 v33.19,68.75
  Bottom 0.254: v58.69,11.25 58.69,6 59.44,5.25 10B.1 | v40.69,10.75 33.19,18.25 33.19,28.25 32.69,28.75 32.69,61.5 33.19,62 v33.19,68.75 | v58.94,68.75 59.44,69.25 59.44,78.5 10B1.1
A4
  Bottom 0.254: 22B1.1 90.07,58.8 90.1,58.77 90.1,42.73 90.07,42.7 22B.1
  Bottom 0.4: 22B.1 90.2,4.95 90.2,4.32 90.07,4.45 22B.1
A5
  Bottom 0.254: 21B.1 87.44,5.25 87.44,44.25 87.19,44.5 87.19,56.75 87.44,57 87.44,78.5 21B1.1
A6  (via drill 0.35)
  Top 0.254: v83.44,73.5 62.19,73.5 62.19,78.5 11A1.1 | v84.94,11.25 77.94,11.25 77.44,10.75 63.94,10.75 62.44,9.25 62.19,9.25 62.19,5.25 11A.1 | v85.19,55.75 84.44,55 v83.19,55 | v83.19,43.25 83.19,42.75 82.69,42.25 82.69,40.25 v83.19,40.25
  Bottom 0.254: 20B1.1 84.94,78.5 84.94,75 v83.44,73.5 85.19,71.75 v85.19,55.75 | 84.94,10.5 84.94,5.25 20B.1 | 84.94,10.5 v84.94,11.25 | v83.19,55 82.94,54.75 82.94,43.5 v83.19,43.25 | v83.19,40.25 83.94,39.5 83.94,37.75 83.44,37.25 83.44,12 84.94,10.5
A7
  Bottom 0.254: 19B.1 82.44,5.25 82.44,58.75 82.69,59 82.69,78.5 19B1.1
A8  (via drill 0.35)
  Top 0.254: v79.69,30.5 74.94,30.5 XC95CPLD.39
  Bottom 0.254: 18B.1 79.69,5.25 v79.69,30.5 79.69,58.5 79.94,58.75 79.94,78.5 18B1.1
A9  (via drill 0.35)
  Top 0.254: 75.44,24.25 76.94,24.25 v77.19,24 | 75.44,24.25 68.94,24.25 67.94,23.25 61.69,23.25 61.69,24.25 62.19,24.75 65.44,24.75 67.69,27 71.44,27 72.19,27.75 XC95CPLD.38 | v77.69,55.25 80.69,52.25 83.94,52.25 85.94,50.25 93.69,50.25 97.69,46.25 97.69,44.5 91.94,44.5 91.69,44.75 90.19,44.75 87.69,42.25 87.69,38.5 v88.19,38.5 | v88.94,29 85.69,25.75 76.94,25.75 75.44,24.25
  Bottom 0.254: v77.19,24 77.19,5.25 17B.1 | v77.69,55.25 77.69,78.25 77.44,78.5 17B1.1 | v88.19,38.5 88.94,37.75 v88.94,29
A10
  Bottom 0.254: 16B.1 74.94,5.25 74.94,9.25 75.94,10.25 75.94,26 75.69,26.25 75.69,27 74.94,27.75 XC95CPLD.37 74.94,28 75.94,29 75.94,31 74.94,32 74.94,78.5 16B1.1
A11
  Bottom 0.254: 73.69,24.25 73.44,24 73.44,6.25 72.44,5.25 15B.1 | 73.69,24.25 74.69,25.25 XC95CPLD.35 | 73.69,24.25 73.69,33.25 71.94,35 71.94,40.75 72.19,41 72.19,78.5 15B1.1
A12  (via drill 0.35)
  Top 0.254: v80.69,23.25 78.94,23.25 | 78.94,23.25 75.19,23.25 74.94,23 XC95CPLD.33 | v80.69,15.75 76.44,11.5 v71.19,11.5 | v69.94,48.5 70.94,47.5 v77.69,47.5 | 78.94,23.25 v77.19,25
  Bottom 0.254: v80.69,23.25 80.44,23 80.44,16 v80.69,15.75 | v71.19,11.5 69.94,10.25 69.94,5.25 14B.1 | v69.94,48.5 69.94,78.5 14B1.1 | v77.69,47.5 77.69,39 77.44,38.75 77.44,25.25 v77.19,25
A13  (via drill 0.35)
  Top 0.254: v70.44,16.5 73.44,16.5 74.69,17.75 XC95CPLD.29 74.94,18 78.69,18 v78.94,18.25 | v66.94,39.5 67.44,39 v73.69,39 | v74.19,35.25 75.69,33.75 v78.19,33.75
  Bottom 0.254: v70.44,16.5 68.94,16.5 68.94,16 68.44,15.5 68.44,6.25 67.44,5.25 13B.1 | v66.94,39.5 66.94,57.75 67.19,58 67.19,78.5 13B1.1 | v73.69,39 74.19,38.5 v74.19,35.25 | v78.19,33.75 78.94,33 v78.94,18.25
A14  (via drill 0.35)
  Top 0.254: v64.94,12 65.94,12 66.44,12.5 69.69,12.5 72.19,15 XC95CPLD.28 72.44,15.25 76.94,15.25 v81.19,19.5 | v64.69,69 59.69,69 59.19,69.5 44.19,69.5 43.94,69.25 40.94,69.25 v40.69,69.5 | v37.44,42 55.44,42 57.44,44 60.19,44 62.44,41.75 62.44,40.25 v68.19,40.25 | v68.94,35.5 69.19,35.75 72.44,35.75 72.69,36 78.19,36 78.44,35.75 v81.19,35.75
  Bottom 0.254: v64.94,12 64.69,11.75 64.69,5.25 12B.1 | v64.69,69 64.69,78.5 12B1.1 | v40.69,69.5 38.19,67 38.19,48 37.44,47.25 v37.44,42 | v68.19,40.25 68.19,36.25 v68.94,35.5 | v81.19,35.75 81.44,35.5 81.44,19.75 v81.19,19.5
A15  (via drill 0.35)
  Top 0.254: v61.44,16.5 68.44,16.5 69.69,17.75 XC95CPLD.27
  Bottom 0.254: 60.94,16 v61.44,16.5 | 60.94,16 60.94,6.25 61.94,5.25 11B.1 | 60.94,16 60.94,18.25 63.19,20.5 63.19,24.25 62.94,24.5 62.94,27.25 63.44,27.75 63.44,33.5 64.69,34.75 64.69,39.5 64.44,39.75 64.44,42.25 62.19,44.5 62.19,54.75 62.44,55 62.44,56 62.19,56.25 62.19,78.5 11B1.1
AREF  (via drill 0.35)
  Top 0.254: v83.94,59.25 91.19,59.25 91.19,57.25 ARDUINO_NANO1.3 | v83.44,71.5 50.69,71.5 49.94,70.75 20.94,70.75 18.19,68 11.94,68 10.19,66.25 J3.8
  Bottom 0.254: v83.94,59.25 83.44,59.75 v83.44,71.5
C0  (via drill 0.35)
  Top 0.254: v86.44,55 90.44,51 v91.44,51 | v91.44,44 94.44,44 94.94,43.5 94.94,39.75 92.69,39.75 89.44,36.5 79.44,36.5 79.19,36.25 78.69,36.25 78.44,36.5 69.44,36.5 69.19,36.25 68.69,36.25 68.44,36 | 68.44,36 68.19,35.75 68.19,33.75 68.44,33.5 68.44,31.5 67.44,30.5 XC95CPLD.1 | v39.44,37 57.44,37 58.44,36 68.44,36
  Bottom 0.254: v86.44,55 86.44,57 ARDUINO_NANO1.5 | v91.44,44 v91.44,51 | v39.44,37 39.44,18 ANALOG.2
C1  (via drill 0.35)
  Top 0.254: v66.94,37.75 v70.94,37.75 | v44.44,53 44.69,52.75 48.69,52.75 49.19,52.25 67.44,52.25 67.69,52.5 71.19,52.5 v71.44,52.75
  Bottom 0.254: v70.94,37.75 70.94,41.75 ARDUINO_NANO1.20 71.19,42 71.69,42.5 71.69,52.5 v71.44,52.75 | v66.94,37.75 67.19,37.5 67.19,33.25 XC95CPLD.44 | v44.44,53 44.44,66 J5.3
C2  (via drill 0.35)
  Top 0.254: v75.69,32.25 73.19,32.25 72.69,31.75 71.69,31.75 70.44,30.5 69.94,30.5 XC95CPLD.43 | v50.94,61.25 v40.19,61.25 | v51.19,54 51.44,53.75 66.69,53.75 67.19,54.25 v69.19,54.25 | v70.94,44 71.19,43.75 74.19,43.75 75.94,42 ARDUINO_NANO1.22
  Bottom 0.254: ARDUINO_NANO1.22 75.44,41.25 75.44,32.5 v75.69,32.25 | v40.19,61.25 40.19,65.5 39.69,66 J5.5 | v50.94,61.25 51.19,61 v51.19,54 | v69.19,54.25 69.19,45.75 v70.94,44
C3  (via drill 0.35)
  Top 0.254: v68.94,37 v78.94,37 | v37.44,62.25 37.69,62 v52.69,62 | v53.69,49.5 54.44,48.75 63.44,48.75 63.69,49 65.19,49 66.69,47.5 v68.19,47.5
  Bottom 0.254: v78.94,37 78.94,41.5 78.69,41.75 ARDUINO_NANO1.23 | 69.44,36.5 69.69,36.25 69.69,33.25 XC95CPLD.42 | 69.44,36.5 v68.94,37 | v37.44,62.25 37.44,65.75 37.19,66 J5.6 | v52.69,62 53.69,61 v53.69,49.5 | v68.19,47.5 68.69,47 68.69,43.25 69.44,42.5 69.44,36.5
C4  (via drill 0.35)
  Top 0.254: v80.44,33.25 80.19,33 72.44,33 XC95CPLD.40 | v34.94,57.5 35.44,57 46.19,57 48.44,54.75 51.69,54.75 51.94,54.5 v62.94,54.5 | v63.19,49.5 65.44,49.5 65.69,49.25 v80.44,49.25
  Bottom 0.254: v80.44,33.25 80.44,41.25 80.94,41.75 ARDUINO_NANO1.24 80.94,42 80.94,48.75 v80.44,49.25 | v34.94,57.5 34.94,65.75 34.69,66 J5.7 | v62.94,54.5 63.19,54.25 v63.19,49.5
CLK  (via drill 0.35)
  Top 0.254: v81.19,51.5 68.19,51.5 67.94,51.25 46.69,51.25 v46.44,51.5 | v46.69,27.75 51.94,27.75 52.94,26.75 58.19,26.75 58.19,28.25 59.19,29.25 60.69,29.25 60.69,30.75 61.69,31.75 63.19,31.75 64.44,33 XC95CPLD.2
  Bottom 0.254: v81.19,51.5 81.19,57 ARDUINO_NANO1.7 | 46.44,27.75 46.44,20.75 44.69,19 44.69,18 ANALOG.4 | 46.44,27.75 v46.44,51.5 | 46.44,27.75 v46.69,27.75
D0  (via drill 0.35)
  Top 0.254: 48.44,15.75 49.94,15.75 55.69,21.5 58.19,21.5 59.44,22.75 XC95CPLD.14 | v47.69,10 47.19,9.5 46.19,9.5 44.44,7.75 44.44,5.25 4A.1 | v33.19,73 35.19,73 35.94,73.75 44.19,73.75 44.19,78.5 4A1.1 | v29.94,20.25 30.44,19.75 32.69,19.75 36.69,15.75 48.44,15.75 | 48.44,15.75 v48.19,16
  Bottom 0.254: v48.19,16 47.69,15.5 v47.69,10 | v33.19,73 29.94,69.75 v29.94,20.25
D1  (via drill 0.35)
  Top 0.254: v59.44,10.5 v50.19,10.5 49.69,10.5 46.94,7.75 46.94,5.25 5A.1 | v46.69,73.75 46.69,78.5 5A1.1 | v45.19,40.5 47.19,38.5 v49.19,38.5
  Bottom 0.254: v59.44,10.5 59.44,15 XC95CPLD.18 | v46.69,73.75 45.69,72.75 45.69,53.25 45.19,52.75 v45.19,40.5 | v49.19,38.5 48.94,38.25 48.94,21 50.94,19 50.94,15 50.19,14.25 v50.19,10.5
D2  (via drill 0.35)
  Top 0.254: v52.69,16 57.69,16 59.44,17.75 XC95CPLD.19 | v50.94,9.5 50.94,5.25 49.44,5.25 6A.1 | v47.69,74.25 49.19,74.25 49.19,78.5 6A1.1 | v38.19,70 37.44,69.25 33.69,69.25 33.44,69.5 28.94,69.5 v28.69,69.25 | v18.69,44 20.94,41.75 36.69,41.75 37.19,41.25 45.89,41.25 47.92,39.22 v50.21,39.22
  Bottom 0.254: v50.94,9.5 50.94,14.25 v52.69,16 52.69,37.37 50.84,39.22 v50.21,39.22 | v47.69,74.25 47.19,74.25 46.94,74.5 44.94,74.5 44.94,72 43.69,70.75 38.19,70.75 v38.19,70 | v28.69,69.25 26.69,71.25 26.69,71.75 26.19,72.25 21.44,72.25 21.44,69.5 18.94,67 18.94,63.5 20.44,62 20.44,50.75 18.69,49 v18.69,44
D3  (via drill 0.35)
  Top 0.254: v66.19,21.5 v62.44,21.5 60.69,21.5 60.69,25.75 61.19,26.25 64.44,26.25 64.44,27.25 63.94,27.75 63.44,27.75 63.44,31 64.19,31.75 65.94,31.75 65.94,33.5 63.94,35.5 56.19,35.5 v55.44,36.25 | v57.94,9.75 57.94,5.25 57.19,5.25 9A.1 | v56.19,74.25 56.94,74.25 56.94,78.5 9A1.1
  Bottom 0.254: v66.19,21.5 66.19,19 67.19,18 XC95CPLD.25 | v62.44,21.5 59.94,19 58.19,19 58.19,11.75 57.94,11.5 v57.94,9.75 | v56.19,74.25 54.94,73 54.94,36.75 v55.44,36.25
D4  (via drill 0.35)
  Top 0.254: v64.19,13.75 68.44,13.75 69.69,15 XC95CPLD.26 | v61.94,10 59.69,7.75 59.69,5.25 10A.1 | v65.44,72.75 62.19,72.75 61.19,73.75 59.69,73.75 59.69,78.5 10A1.1
  Bottom 0.254: v61.94,10 61.94,13.75 v64.19,13.75 64.94,13.75 65.94,14.75 65.94,18.25 65.44,18.75 65.44,21.75 65.94,22.25 65.94,39 64.94,40 64.94,57.5 65.44,58 v65.44,72.75
D5  (via drill 0.35)
  Top 0.254: v66.69,11.75 66.19,11.25 60.19,11.25 59.44,12 56.44,12 v56.19,11.75 | v56.19,9.75 54.69,8.25 54.69,5.25 8A.1 | v61.44,72.25 60.44,72.25 59.19,73.5 54.69,73.5 54.69,78.5 8A1.1 | v61.44,68.25 64.94,64.75 v67.94,64.75
  Bottom 0.254: v66.69,11.75 66.69,14.5 67.19,15 XC95CPLD.24 67.44,15.25 68.44,16.25 68.44,33.5 67.69,34.25 67.69,39.75 67.44,40 67.44,57.5 67.69,57.75 67.69,64.5 v67.94,64.75 | v56.19,9.75 v56.19,11.75 | v61.44,68.25 v61.44,72.25
D6  (via drill 0.35)
  Top 0.254: v56.19,14.25 56.44,14 60.94,14 61.94,15 XC95CPLD.20 | v55.19,9.75 54.94,9.5 53.69,9.5 52.19,8 52.19,5.25 7A.1 | v50.69,77.25 51.94,78.5 7A1.1 | v50.44,72.25 49.69,71.5 v25.94,71.5 | v23.44,13.75 25.69,11.5 49.19,11.5 49.44,11.75 v55.19,11.75
  Bottom 0.254: v56.19,14.25 55.19,13.25 v55.19,11.75 v55.19,9.75 | v50.69,77.25 50.44,77 v50.44,72.25 | v25.94,71.5 21.44,67 21.44,38.25 20.44,37.25 20.44,16.75 v23.44,13.75
D7
  Top 0.254: 1A.1 36.69,5.25 35.52,6.42 18.96,6.42 17.92,7.45 14.9,7.45 13.95,6.5 5.94,6.5 5.19,7.25 5.19,32.25 2.94,32.25 1.19,34 1.19,78.5 25.44,78.5 27.44,80.5 34.94,80.5 36.69,78.75 1A1.1
GND  (via drill 0.35)
  Top 0.4: v95.69,19.5 84.19,19.5 84.19,14.75 IC1.1 | XC95CPLD.23 64.69,18 65.69,19 72.69,19 73.94,20.25 74.69,20.25 XC95CPLD.31 74.94,20.5 80.19,20.5 82.44,22.75 96.94,22.75 96.94,26 95.19,27.75 JP3.2 | v63.69,27 60.44,27 59.69,27.75 XC95CPLD.10 | ARDUINO_NANO1.19 68.44,41.75 67.44,40.75 65.44,40.75 64.44,41.75 64.44,44.75 v64.19,44.75 v53.69,44.75 | v63.94,69.75 94.94,69.75 DIS0.1 | v53.69,27.5 v55.69,27.5 | IC3.1 27.94,50.75 27.94,48.5 IC3.2 | J2.6 26.94,17.75 29.19,17.75 J2.7 29.19,18 29.19,20.75 29.44,21 44.19,21 v45.94,19.25 | v44.19,72.25 20.44,72.25 JP8.1 | v24.69,55 15.69,64 14.69,64 12.69,66 J3.7 | v45.94,14.5 v53.44,14.5
  Bottom 0.4: v95.69,19.5 96.94,20.75 96.94,26 95.19,27.75 JP3.2 | v63.69,27 64.44,26.25 64.44,18 XC95CPLD.23 | v64.19,44.75 63.94,45 v63.94,48.25 63.94,56.5 63.44,57 ARDUINO_NANO1.14 63.69,57 63.69,69.5 v63.94,69.75 | v55.69,27.5 55.69,26.75 58.44,26.75 59.44,27.75 XC95CPLD.10 | v53.69,44.75 53.69,42.1 | 53.69,42.1 v53.69,27.5 53.44,27.25 v53.44,14.5 | 45.94,5.25 46.69,5.25 5B.1 | 45.94,5.25 44.44,5.25 4B.1 | IC3.2 27.94,48.25 27.94,45.75 IC3.3 27.69,45.5 25.94,43.75 25.94,35 27.69,33.25 IC3.8 27.69,33 26.94,32.25 26.94,18 J2.6 | v45.94,19.25 v45.94,14.5 45.94,5.25 | U$1.3 6.19,5.5 4.94,6.75 4.94,14.5 5.69,15.25 5.69,39 7.19,40.5 JC1.8 7.44,40.75 8.69,42 8.69,50 12.44,53.75 12.44,66 J3.7 12.69,66.25 12.69,68 | 5B1.1 46.69,78.75 44.44,78.75 4B1.1 44.19,78.5 v44.19,72.25 | 12.69,68 15.94,68 20.19,72.25 JP8.1 20.44,72.5 20.44,73.25 22.18,74.99 S2.4 S2.3 15.65,75.25 12.69,75.25 | 12.69,68 12.69,75.25 | 12.69,75.25 12.69,76.5 10.84,78.35 S1.2 S1.1 | v24.69,55 24.69,54 27.69,51 IC3.1 | 53.69,42.1 JP2.6
  pour Bottom (isolate 0.2): -0.1,82.55 100.23,82.55 100.23,0 -0.1,0
  pour Top (isolate 0.254): -0.1,82.55 100.1,82.55 100.1,0 -0.1,0
GPX  (via drill 0.35)
  Top 0.254: v86.19,51 83.94,53.25 82.19,53.25 79.69,55.75 79.69,60.5 52.19,60.5 51.69,60 v29.19,60
  Bottom 0.254: v86.19,51 86.19,42 ARDUINO_NANO1.26 | v29.19,60 27.94,61.25 27.94,66 J3.1
INT  (via drill 0.35)
  Top 0.254: v70.94,48.5 v88.69,48.5 | v70.69,54.75 70.19,55.25 62.19,55.25 61.94,55 52.19,55 48.94,58.25 v29.19,58.25
  Bottom 0.254: v88.69,48.5 88.69,42 ARDUINO_NANO1.27 | v70.94,48.5 70.69,48.75 v70.69,54.75 | v29.19,58.25 25.44,62 25.44,66 J3.2
MISO  (via drill 0.35)
  Top 0.254: v96.94,45.25 94.44,47.75 78.94,47.75 77.94,46.75 56.19,46.75 55.94,47 54.34,47 52.02,44.68 51.16,44.68 50.12,45.72 JP2.1 47.45,49.25 38.19,49.25 v37.44,50 | v19.69,61.75 26.19,55.25 v36.44,55.25
  Bottom 0.254: v96.94,45.25 96.94,42.5 96.44,42 ARDUINO_NANO1.30 | v19.69,61.75 18.44,63 18.44,65.25 17.69,66 J3.5 | v36.44,55.25 37.44,54.25 v37.44,50
MOSI  (via drill 0.35)
  Top 0.254: v93.44,45.25 93.19,45.5 53.51,45.5 53.03,45.02 53.03,44.62 JP2.4 51.59,43.56 50.95,44.2 49.51,44.2 49.48,44.22 48.69,44.22 48.16,44.75 34.44,44.75 32.44,46.75 v20.69,46.75
  Bottom 0.254: v93.44,45.25 93.44,42.25 93.69,42 ARDUINO_NANO1.29 | v20.69,46.75 20.94,47 20.94,65.5 20.44,66 J3.4
N$1
  Top 0.254: JP6.3 50.94,26.5 51.94,25.5 56.94,25.5 XC95CPLD.11
N$2
  Top 0.254: XC95CPLD.12 58.44,24.25 50.94,24.25 JP6.2
N$3
  Top 0.254: JP6.1 50.94,21.75 51.94,22.75 56.94,22.75 XC95CPLD.13
N$29  (via drill 0.35)
  Top 0.254: IC3.4 27.69,43.25 22.94,43.25 R1.2 21.19,44.75 v12.94,44.75
  Bottom 0.254: v12.94,44.75 10.44,47.25 JC1.1
N$32
  Top 0.254: IC3.5 27.69,40.75 22.94,40.75 R2.2 22.69,40.75 21.19,40.75 20.19,41.75 13.19,41.75 10.44,44.5 JC1.2
N$33
  Top 0.254: IC3.6 27.69,38.25 22.94,38.25 R3.2 22.69,38.25 21.69,39.25 12.94,39.25 10.44,41.75 JC1.3
N$34  (via drill 0.35)
  Top 0.254: R4.2 22.94,35.75 27.69,35.75 IC3.7 | v21.19,37 14.69,37 13.44,38.25 11.19,38.25 10.44,39 JC1.4
  Bottom 0.254: v21.19,37 22.69,35.5 R4.2
N$35  (via drill 0.35)
  Top 0.254: IC3.10 35.69,35.75 40.44,35.75 R5.2 | v38.94,44 38.69,44.25 27.19,44.25 25.44,46 7.44,46 JC1.6
  Bottom 0.254: v38.94,44 40.44,42.5 40.44,35.75 R5.2
N$36
  Top 0.254: IC3.9 33.94,31.5 16.19,31.5 15.19,30.5 R10.2
  Bottom 0.254: R10.2 14.94,30.5 10.44,35 10.44,36.25 JC1.5
N$37
  Top 0.254: 38.69,36.5 38.69,36.25 39.69,36.25 39.94,36.5 43.44,36.5 44.19,35.75 R6.2 | 38.69,36.5 38.69,37.5 35.69,40.5 IC3.12 | 38.69,36.5 34.19,36.5 29.69,32 14.69,32 13.94,32.75 3.19,32.75 2.61,33.33 2.61,73.26 3,73.66 S1.3
  Bottom 0.4: S1.3 4.7,75.46 4.71,75.47 7.79,75.47 7.8,75.46 S1.4
N$38
  Top 0.254: JP1.2 27.69,78.5 25.82,76.63 13.32,76.63 9.89,73.2 9.89,70.25 7.76,68.11 4.8,68.11 3.69,67 3.69,43.5 7.19,43.5 JC1.7
N$39
  Top 0.254: JC1.9 7.44,37.75 11.44,37.75 11.44,36.75 14.94,33.25 R9.2 15.19,33.25 18.44,33.25 22.19,37 34.44,37 35.44,38 IC3.11
NRST  (via drill 0.35)
  Top 0.254: v72.94,43 72.44,42.5 72.44,40.5 v72.69,40.5 | v72.94,35.25 70.94,33.25 70.94,31.75 69.44,31.75 68.44,30.75 68.44,29.25 65.69,29.25 64.69,30.25 XC95CPLD.3
  Bottom 0.254: v72.94,43 72.69,43.25 72.69,56.25 73.44,57 ARDUINO_NANO1.10 | v72.69,40.5 72.94,40.25 v72.94,35.25
PS2CLK  (via drill 0.35)
  Top 0.254: v73.44,53.5 70.19,53.5 69.69,53 67.44,53 67.19,52.75 49.44,52.75 48.44,53.75 v43.44,53.75 43.19,53.5 24.19,53.5 v19.44,48.75
  Bottom 0.254: v73.44,53.5 73.44,52.5 73.69,52.25 73.69,42 ARDUINO_NANO1.21 | v43.44,53.75 43.69,54 43.69,64.5 42.19,66 J5.4 | v19.44,48.75 19.44,32.5 15.44,28.5 15.44,12 8.94,5.5 U$1.5
PS2DATA  (via drill 0.35)
  Top 0.254: v83.69,47 82.94,46.25 v55.69,46.25 | v55.69,40.5 52.94,37.75 v42.44,37.75 | v40.69,14.5 13.19,14.5 6.44,7.75 U$1.1
  Bottom 0.254: v83.69,47 83.94,47.25 83.94,57 ARDUINO_NANO1.6 | v55.69,40.5 v55.69,46.25 | v42.44,37.75 42.19,37.5 42.19,18 ANALOG.3 41.94,17.75 41.94,15.75 v40.69,14.5
RES  (via drill 0.35)
  Top 0.254: v84.19,60.25 83.44,61 51.69,61 51.19,60.5 34.19,60.5 v32.44,62.25
  Bottom 0.254: v84.19,60.25 84.69,59.75 84.69,56.75 84.44,56.5 84.44,46.75 83.94,46.25 83.94,42 ARDUINO_NANO1.25 | v32.44,62.25 31.94,62.75 31.94,66 J5.8
SCK  (via drill 0.35)
  Top 0.254: v96.19,68.25 95.69,68.75 71.94,68.75 71.69,69 v69.19,69 | v68.69,63.25 67.94,62.5 v53.69,62.5 53.19,63 37.19,63 v36.44,62.25 | v36.44,56.25 30.19,56.25 23.94,62.5 18.69,62.5 15.19,66 J3.6
  Bottom 0.254: v96.19,68.25 96.19,57.25 ARDUINO_NANO1.1 | v69.19,69 68.69,68.5 v68.69,63.25 | v53.69,62.5 53.19,62.5 52.94,62.75 51.94,62.75 51.94,50.25 50.19,48.5 50.19,44.96 49.05,43.81 JP2.3 | v36.44,62.25 v36.44,56.25
SCL  (via drill 0.35)
  Top 0.254: v76.19,64.75 94.94,64.75 DIS0.3 | 37.19,47.25 35.69,45.75 IC3.14 | 37.19,47.25 40.69,47.25 41.69,48.25 R7.1 | v36.69,26.25 47.44,26.25 47.44,22.5 49.44,20.5 49.44,18 ANALOG.6 | 37.19,47.25 29.69,47.25 | 29.69,47.25 26.69,47.25 25.69,48.25 19.94,48.25 19.69,48 18.69,48 18.69,52.5 5.19,66 J3.10 | v75.69,52.25 75.44,52 67.94,52 67.69,51.75 47.19,51.75 46.69,52.25 34.69,52.25 29.69,47.25
  Bottom 0.254: v76.19,64.75 76.19,57.25 ARDUINO_NANO1.9 75.94,57 75.69,56.75 v75.69,52.25 | v36.69,26.25 33.69,29.25 33.69,43.75 35.44,45.5 IC3.14
SDA  (via drill 0.35)
  Top 0.254: v78.69,62.25 94.94,62.25 DIS0.4 | IC3.15 35.69,48.25 39.19,48.25 R8.1 | v38.69,25.5 46.94,25.5 46.94,18 ANALOG.5 | J3.9 7.69,66 19.44,54.25 v33.94,54.25 34.19,54.5 43.69,54.5 43.94,54.25 48.69,54.25 49.69,53.25 66.94,53.25 67.19,53.5 69.44,53.5 69.94,54 70.94,54 71.19,54.25 75.69,54.25 78.44,57 ARDUINO_NANO1.8
  Bottom 0.254: v78.69,62.25 78.69,57.25 ARDUINO_NANO1.8 | v38.69,25.5 38.19,26 38.19,47.25 39.19,48.25 R8.1 | v33.94,54.25 33.69,54 33.69,50.25 35.44,48.5 IC3.15
SPARE1  (via drill 0.35)
  Top 0.254: v37.44,28.75 43.19,34.5 48.69,34.5 49.69,35.5 55.44,35.5 55.94,35 60.19,35 61.94,33.25 XC95CPLD.4 | v91.69,55 90.69,55 90.19,55.5 88.94,55.5 88.94,57 ARDUINO_NANO1.4 | v91.94,40.75 91.69,40.5 91.19,40.5 88.44,37.75 71.94,37.75 71.19,38.5 63.69,38.5 JP7.3
  Bottom 0.254: v37.44,28.75 37.44,18.25 37.19,18 ANALOG.1 | v91.69,55 92.19,54.5 92.19,42.5 92.44,42.25 92.44,41.25 v91.94,40.75 | XC95CPLD.4 62.19,33.25 63.44,34.5 63.44,38.25 JP7.3
SPARE2  (via drill 0.35)
  Top 0.254: v61.69,55.75 69.69,55.75 70.94,57 ARDUINO_NANO1.11
  Bottom 0.254: v61.69,55.75 61.69,42.5 61.94,42.25 61.94,39.25 61.19,38.5 JP7.2 60.94,38.25 60.94,31.5 61.94,30.5 XC95CPLD.5
SPARE3
  Bottom 0.254: JP7.1 58.69,38.25 59.44,37.5 59.44,33.25 XC95CPLD.6
SPARE4
  Top 0.254: JP5.3 50.94,34.25 54.69,30.5 56.94,30.5 XC95CPLD.7
SPARE5
  Top 0.254: JP5.2 50.94,31.75 53.44,29.25 58.44,29.25 59.44,30.25 XC95CPLD.8
SPARE6
  Top 0.254: JP5.1 50.94,29 51.69,28.25 56.69,28.25 56.94,28 XC95CPLD.9
SS  (via drill 0.35)
  Top 0.254: v90.94,55.75 89.94,56.75 89.94,58.5 v89.44,58.5 | v88.19,63.5 87.69,64 64.69,64 60.69,68 24.69,68 22.94,66.25 J3.3
  Bottom 0.254: v90.94,55.75 90.69,55.5 90.69,42.5 91.19,42 ARDUINO_NANO1.28 | v89.44,58.5 88.19,59.75 v88.19,63.5
TCK  (via drill 0.35)
  Top 0.254: v78.94,35 79.69,35 81.69,33 91.69,33 93.19,31.5 93.94,31.5 94.94,30.5 JP4.1 | v78.19,38.5 76.94,39.75 v70.19,39.75 | v69.19,23.5 66.44,20.75 61.69,20.75 59.94,19 58.19,19 57.19,18 XC95CPLD.17
  Bottom 0.254: v78.94,35 78.19,35.75 v78.19,38.5 | v70.19,39.75 70.19,34.25 70.94,33.5 70.94,29 69.19,27.25 v69.19,23.5
TDI  (via drill 0.35)
  Top 0.254: v91.94,34.75 94.19,34.75 94.94,35.5 JP4.3 | v91.44,32.25 90.69,31.5 75.44,31.5 75.19,31.75 74.44,31.75 73.44,30.75 73.44,29.25 69.19,29.25 65.44,25.5 v61.44,25.5
  Bottom 0.254: v91.94,34.75 91.44,34.25 v91.44,32.25 | v61.44,25.5 59.94,24 58.19,24 58.19,21.5 57.19,20.5 XC95CPLD.15
TDO
  Top 0.254: JP4.2 95.19,33 96.19,32 96.69,32 97.44,31.25 97.44,22.25 82.69,22.25 79.44,19 73.44,19 72.44,18 XC95CPLD.30
TMS  (via drill 0.35)
  Top 0.254: v62.44,24 66.19,24 68.69,26.5 73.44,26.5 73.44,28.25 74.44,29.25 75.19,29.25 75.69,29.75 89.19,29.75 89.69,29.25 96.94,29.25 96.94,31 96.44,31.5 95.94,31.5 95.44,32 93.44,32 93.44,33.5 94.19,34.25 96.94,34.25 96.94,36.25 95.19,38 JP4.4
  Bottom 0.254: v62.44,24 59.69,21.25 59.69,20.5 XC95CPLD.16
VCC  (via drill 0.35)
  Top 0.4: U$1.4 6.44,12.5 9.69,15.75 14.44,15.75 16.44,17.75 J2.2 | R8.2 39.44,56 41.69,56 R7.2 | R6.1 44.19,28 40.69,28 R5.1 40.44,28 25.19,28 22.94,30.25 R10.1 | v93.31,17.89 91.82,17.89 88.69,14.75 IC1.3 | JP8.2 17.69,72.5 19.44,74.25 20.69,74.25 20.94,74 25.69,74 30.19,78.5 JP1.1 | v68.19,50.5 68.07,50.38 52.3,50.38 51.59,49.66 JP2.2 51.59,50.11 51.6,50.11 50.96,50.75 v42.69,50.75 35.69,50.75 IC3.16 | v93.69,61.5 69.44,61.5 v69.19,61.75
  Bottom 0.4: R1.1 15.19,43 15.19,40.75 R2.1 15.19,40.5 15.19,38.25 R3.1 15.19,38 15.19,35.75 R4.1 15.19,35.5 16.19,34.5 16.19,30 6.44,20.25 6.44,12.5 U$1.4 | R7.2 42.69,55 v42.69,50.75 42.69,49 43.19,48.5 43.19,29 44.19,28 R6.1 | R9.1 22.69,33 22.69,30.5 R10.1 22.94,30.25 22.94,19.25 24.19,18 J2.5 24.44,17.75 24.44,10 | 24.44,10 24.44,5.25 36.69,5.25 1B.1 | 24.44,10 16.69,17.75 J2.2 | v93.31,17.89 93.19,18.01 93.19,39.75 94.94,41.5 94.94,60.75 94.06,61.62 | 94.06,61.62 93.94,61.75 93.94,66.25 94.94,67.25 DIS0.2 | 35.69,78.75 30.44,78.75 JP1.1 | 35.69,78.75 36.69,78.75 1B1.1 | v68.19,50.5 68.19,56.75 68.44,57 ARDUINO_NANO1.12 68.69,57.25 68.69,61.25 v69.19,61.75 | 35.69,78.75 35.69,51 IC3.16 | v93.69,61.5 93.94,61.5 94.06,61.62

### Text on the board
tNames: 5V | GND | TMS | TDI | TDO | TCK | GND | VREF | ZX81 KBD+ v0.4 / (C) 2023 Alejandro Valero / (Wilco2009)